# Altium schematic sheet 11 SDRAM.SchDoc
size A2; VersionControl_RevNumber: DNP; IsUserConfigurable: DNP; OrgAddr3: Sunrise FL 33323; OrgName: Pixels on Target; Page Create Date: March  8, 1995; Page Number: 5; Page Size: A2; Page Count: 14; OrgAddr2: Suite #104; RevCode: A; Doc: SCH30-00070-00; DsnPath: C:\Users\Carter Nichols\Documents\BitBucket boards (Cadence)\30-00070-00_Original\SCH30-00070-00.DSN; SchematicName: SC30-00070-00; PageName: 05-POWER IN; PageSize: A2; TopSchematic: True; Address4: United States
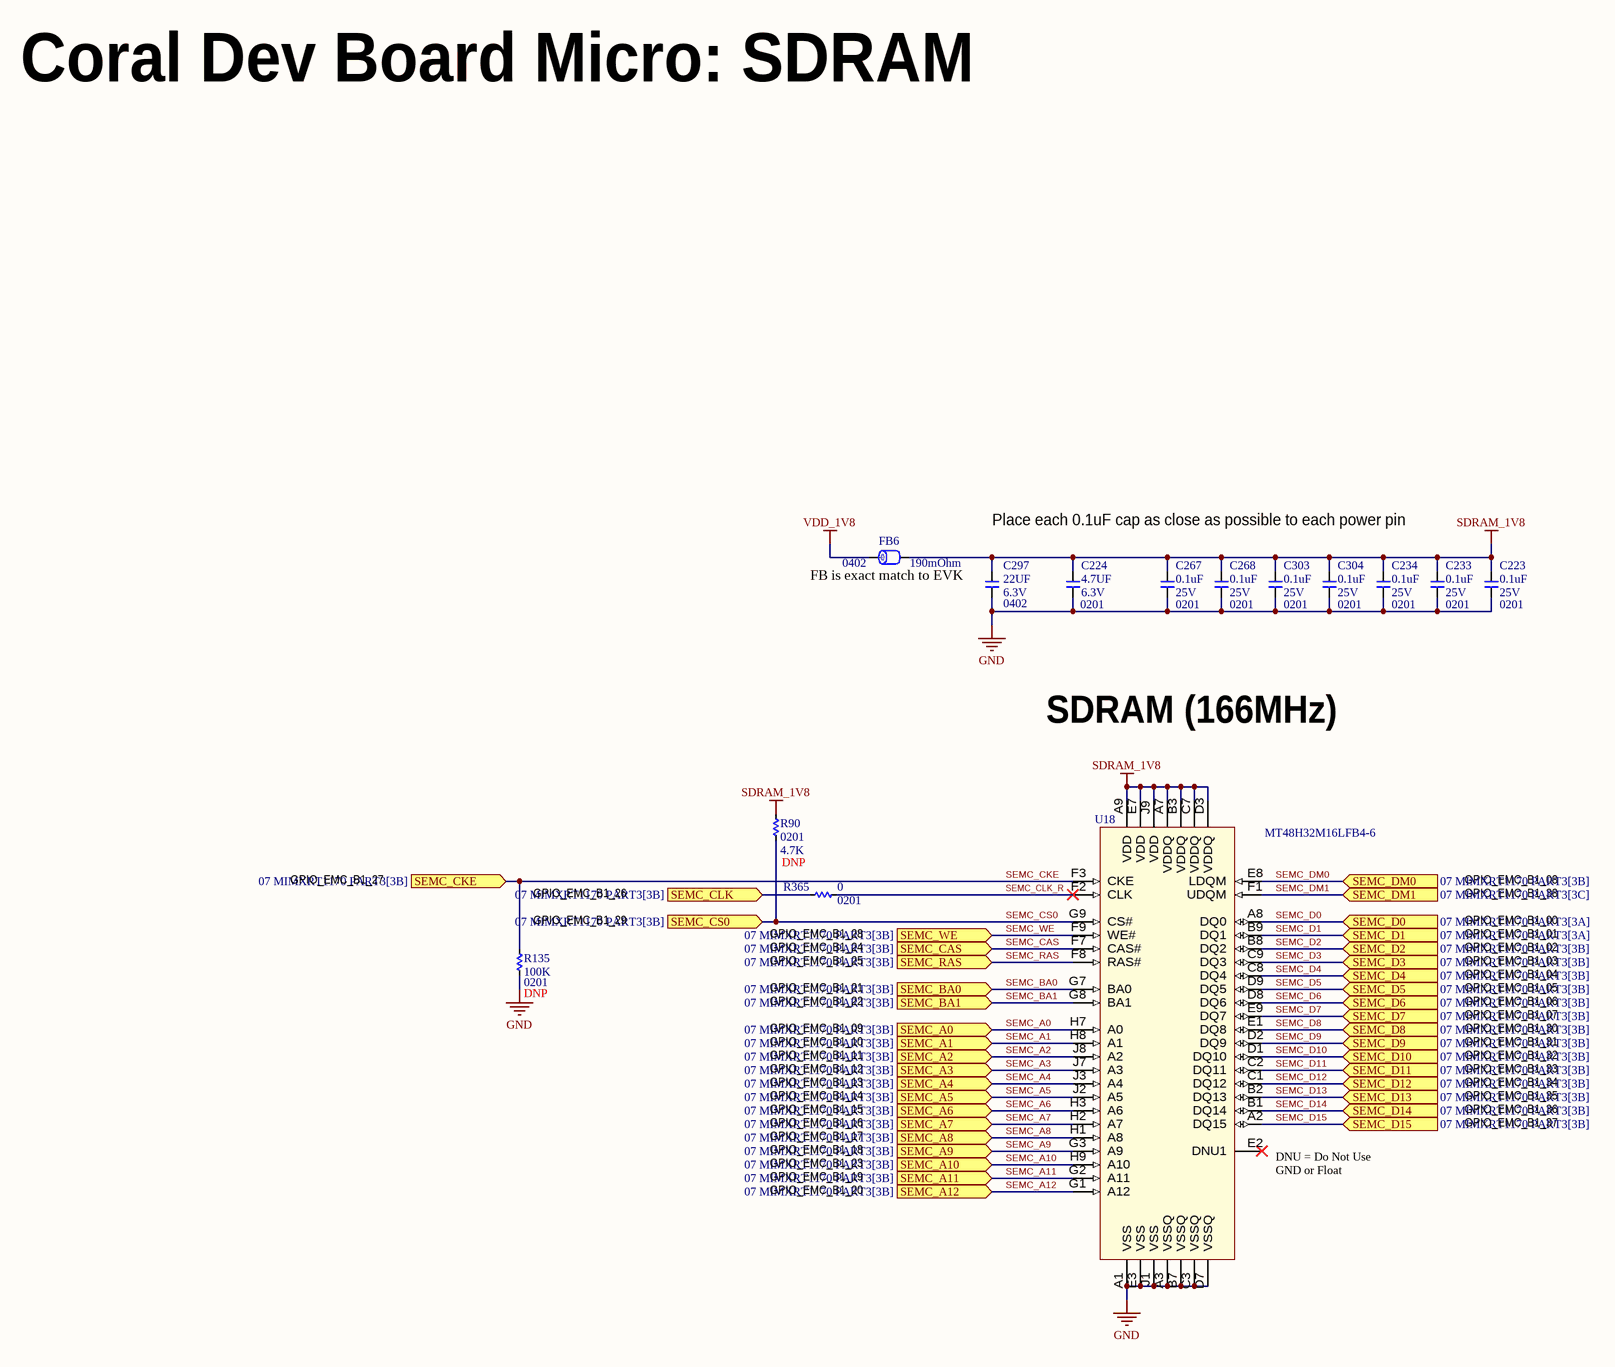
[diagram p0: 11 SDRAM.SchDoc]

## Parts
C223  value 0.1uF  Package: 0201  Voltage: 25V  [C0201Y]  (hidden comment: __Template_Cap)
C224  value 4.7UF  Package: 0201  Voltage: 6.3V  [C0201Y]  (hidden comment: __Template_Cap)
C233  value 0.1uF  Package: 0201  Voltage: 25V  [C0201Y]  (hidden comment: __Template_Cap)
C234  value 0.1uF  Package: 0201  Voltage: 25V  [C0201Y]  (hidden comment: __Template_Cap)
C267  value 0.1uF  Package: 0201  Voltage: 25V  [C0201Y]  (hidden comment: __Template_Cap)
C268  value 0.1uF  Package: 0201  Voltage: 25V  [C0201Y]  (hidden comment: __Template_Cap)
C297  value 22UF  Package: 0402  Voltage: 6.3V  [C0402]  (hidden comment: __Template_Cap)
C303  value 0.1uF  Package: 0201  Voltage: 25V  [C0201Y]  (hidden comment: __Template_Cap)
C304  value 0.1uF  Package: 0201  Voltage: 25V  [C0201Y]  (hidden comment: __Template_Cap)
FB6  Package: 0402  Rdc max: 190mOhm  [L0402_H0.55MM]  (hidden comment: __Template_Ferrite_Bead)
R90  value 4.7K  Package: 0201  [R0201]
R135  value 100K  Package: 0201  [R0201]
R365  value 0  Package: 0201  [R0201]
U18  MFG P/N: MT48H32M16LFB4-6  [BGA54C80P6X9_800X800X100]  (hidden comment: SDRAM_MT48H32M16LFB4-6)

## Ports
SEMC_A0 (in, see 07 MIMXRT1170 PART3[3B]), SEMC_A1 (in, see 07 MIMXRT1170 PART3[3B]), SEMC_A2 (in, see 07 MIMXRT1170 PART3[3B]), SEMC_A3 (in, see 07 MIMXRT1170 PART3[3B]), SEMC_A4 (in, see 07 MIMXRT1170 PART3[3B]), SEMC_A5 (in, see 07 MIMXRT1170 PART3[3B]), SEMC_A6 (in, see 07 MIMXRT1170 PART3[3B]), SEMC_A7 (in, see 07 MIMXRT1170 PART3[3B]), SEMC_A8 (in, see 07 MIMXRT1170 PART3[3B]), SEMC_A9 (in, see 07 MIMXRT1170 PART3[3B]), SEMC_A10 (in, see 07 MIMXRT1170 PART3[3B]), SEMC_A11 (in, see 07 MIMXRT1170 PART3[3B]), SEMC_A12 (in, see 07 MIMXRT1170 PART3[3B]), SEMC_BA0 (in, see 07 MIMXRT1170 PART3[3B]), SEMC_BA1 (in, see 07 MIMXRT1170 PART3[3B]), SEMC_CAS (in, see 07 MIMXRT1170 PART3[3B]), SEMC_CKE (in, see 07 MIMXRT1170 PART3[3B]), SEMC_CLK (in, see 07 MIMXRT1170 PART3[3B]), SEMC_CS0 (in, see 07 MIMXRT1170 PART3[3B]), SEMC_D0 (in, see 07 MIMXRT1170 PART3[3A]), SEMC_D1 (in, see 07 MIMXRT1170 PART3[3A]), SEMC_D2 (in, see 07 MIMXRT1170 PART3[3B]), SEMC_D3 (in, see 07 MIMXRT1170 PART3[3B]), SEMC_D4 (in, see 07 MIMXRT1170 PART3[3B]), SEMC_D5 (in, see 07 MIMXRT1170 PART3[3B]), SEMC_D6 (in, see 07 MIMXRT1170 PART3[3B]), SEMC_D7 (in, see 07 MIMXRT1170 PART3[3B]), SEMC_D8 (in, see 07 MIMXRT1170 PART3[3B]), SEMC_D9 (in, see 07 MIMXRT1170 PART3[3B]), SEMC_D10 (in, see 07 MIMXRT1170 PART3[3B]), SEMC_D11 (in, see 07 MIMXRT1170 PART3[3B]), SEMC_D12 (in, see 07 MIMXRT1170 PART3[3B]), SEMC_D13 (in, see 07 MIMXRT1170 PART3[3B]), SEMC_D14 (in, see 07 MIMXRT1170 PART3[3B]), SEMC_D15 (in, see 07 MIMXRT1170 PART3[3B]), SEMC_DM0 (in, see 07 MIMXRT1170 PART3[3B]), SEMC_DM1 (in, see 07 MIMXRT1170 PART3[3C]), SEMC_RAS (in, see 07 MIMXRT1170 PART3[3B]), SEMC_WE (in, see 07 MIMXRT1170 PART3[3B])

## Nets
GND: C223.2 C224.2 C233.2 C234.2 C267.2 C268.2 C297.2 C303.2 C304.2 R135.1 U18.A1(VSS) U18.A3(VSSQ) U18.B7(VSSQ) U18.C3(VSSQ) U18.D7(VSSQ) U18.E3(VSS) U18.J1(VSS)
SDRAM_1V8: C223.1 C224.1 C233.1 C234.1 C267.1 C268.1 C297.1 C303.1 C304.1 FB6.2 R90.2 U18.A7(VDDQ) U18.A9(VDD) U18.B3(VDDQ) U18.C7(VDDQ) U18.D3(VDDQ) U18.E7(VDD) U18.J9(VDD)
VDD_1V8: FB6.1
SEMC_A0: U18.H7(A0) ; port SEMC_A0
SEMC_A1: U18.H8(A1) ; port SEMC_A1
SEMC_A2: U18.J8(A2) ; port SEMC_A2
SEMC_A3: U18.J7(A3) ; port SEMC_A3
SEMC_A4: U18.J3(A4) ; port SEMC_A4
SEMC_A5: U18.J2(A5) ; port SEMC_A5
SEMC_A6: U18.H3(A6) ; port SEMC_A6
SEMC_A7: U18.H2(A7) ; port SEMC_A7
SEMC_A8: U18.H1(A8) ; port SEMC_A8
SEMC_A9: U18.G3(A9) ; port SEMC_A9
SEMC_A10: U18.H9(A10) ; port SEMC_A10
SEMC_A11: U18.G2(A11) ; port SEMC_A11
SEMC_A12: U18.G1(A12) ; port SEMC_A12
SEMC_BA0: U18.G7(BA0) ; port SEMC_BA0
SEMC_BA1: U18.G8(BA1) ; port SEMC_BA1
SEMC_CAS: U18.F7(CAS#) ; port SEMC_CAS
SEMC_CKE: R135.2 U18.F3(CKE) ; port SEMC_CKE
SEMC_CLK: R365.1 ; port SEMC_CLK
SEMC_CLK_R: R365.2 U18.F2(CLK)
SEMC_CS0: R90.1 U18.G9(CS#) ; port SEMC_CS0
SEMC_D0: U18.A8(DQ0) ; port SEMC_D0
SEMC_D1: U18.B9(DQ1) ; port SEMC_D1
SEMC_D2: U18.B8(DQ2) ; port SEMC_D2
SEMC_D3: U18.C9(DQ3) ; port SEMC_D3
SEMC_D4: U18.C8(DQ4) ; port SEMC_D4
SEMC_D5: U18.D9(DQ5) ; port SEMC_D5
SEMC_D6: U18.D8(DQ6) ; port SEMC_D6
SEMC_D7: U18.E9(DQ7) ; port SEMC_D7
SEMC_D8: U18.E1(DQ8) ; port SEMC_D8
SEMC_D9: U18.D2(DQ9) ; port SEMC_D9
SEMC_D10: U18.D1(DQ10) ; port SEMC_D10
SEMC_D11: U18.C2(DQ11) ; port SEMC_D11
SEMC_D12: U18.C1(DQ12) ; port SEMC_D12
SEMC_D13: U18.B2(DQ13) ; port SEMC_D13
SEMC_D14: U18.B1(DQ14) ; port SEMC_D14
SEMC_D15: U18.A2(DQ15) ; port SEMC_D15
SEMC_DM0: U18.E8(LDQM) ; port SEMC_DM0
SEMC_DM1: U18.F1(UDQM) ; port SEMC_DM1
SEMC_RAS: U18.F8(RAS#) ; port SEMC_RAS
SEMC_WE: U18.F9(WE#) ; port SEMC_WE

Not connected (* = marked no-connect by the designer): U18 E2(DNU1)*

## Notes on the sheet
- Coral Dev Board Micro: SDRAM
- FB is exact match to EVK
- Place each 0.1uF cap as close as possible to each power pin
- SDRAM (166MHz)
- GPIO_EMC_B1_27
- GPIO_EMC_B1_26
- GPIO_EMC_B1_38
- GPIO_EMC_B1_08
- (near R135) GPIO_EMC_B1_29
- GPIO_EMC_B1_21
- GPIO_EMC_B1_25
- (near R365) GPIO_EMC_B1_24
- (near R365) GPIO_EMC_B1_28
- GPIO_EMC_B1_00
- GPIO_EMC_B1_01
- GPIO_EMC_B1_02
- GPIO_EMC_B1_03
- GPIO_EMC_B1_04
- GPIO_EMC_B1_05
- GPIO_EMC_B1_10
- GPIO_EMC_B1_09
- GPIO_EMC_B1_22
- GPIO_EMC_B1_06
- GPIO_EMC_B1_07
- GPIO_EMC_B1_30
- GPIO_EMC_B1_31
- GPIO_EMC_B1_11
- GPIO_EMC_B1_12
- GPIO_EMC_B1_13
- GPIO_EMC_B1_14
- GPIO_EMC_B1_15
- GPIO_EMC_B1_16
- GPIO_EMC_B1_32
- GPIO_EMC_B1_33
- GPIO_EMC_B1_34
- GPIO_EMC_B1_35
- GPIO_EMC_B1_36
- GPIO_EMC_B1_37
- GPIO_EMC_B1_17
- GPIO_EMC_B1_18
- GPIO_EMC_B1_19
- GPIO_EMC_B1_23
- (near U18) DNU = Do Not Use
- (near U18) GND or Float
- GPIO_EMC_B1_20
- Title
- Size:
- Date:
- File:
- A2
- Number:
- Time:
- Revision:
- Sheet
- of

## Library data of the parts
C223 C233 C234 C267 C268 C303 C304 = 386: CAP, CER, X5R, 0.1uF, 25V, 20%, 0201, 0.33mm T; ID: 386; MFG: MURATA; MFG P/N: GRM033R61E104ME14D; XPN: 150-01204-00; Status: Released; Dielectric: X5R; Tolerance: 20%; Height: 0.33mm T; ComponentLink1Description: Datasheet; COMMON: 150-01204-00; LOON: 150-01204-00; Gecko: 150-01204-00
C224 = 1199: CAP, CER, X5R, 4.7uF, 20%, 6.3V, 0201; ID: 1199; MFG: MURATA; MFG P/N: GRM035R60J475ME15D; XPN: 150-01224-00; PROXY: 150-03477-00; Status: Released; Dielectric: X5R; Tolerance: 20%; Height: 0.33mm T; ComponentLink1Description: Datasheet; COMMON: 150-01224-00; LOON: 150-01224-00; Gecko: 150-01224-00
C297 = 1719: CAP, CER, X5R, 22uF, 20%, 6.3V, 0402; ID: 1719; MFG: AVX; MFG P/N: 04026D226MAT2A; XPN: 150-00420-00; PROXY: 150-03491-00; Status: Released; Dielectric: X5R; Tolerance: 20%; Height: 0.70mm; Supplier 1: Digi-Key; HelpURL: https://www.digikey.in/product-detail/en/avx-corporation/04026D226MAT2A/478-9839-1-ND/5964924; ComponentLink1Description: Datasheet; ComponentLink1URL: http://datasheets.avx.com/cx5r.pdf; COMMON: 150-00420-00; LOON: 150-00420-00; Gecko: 150-00420-00; Supplier Part Number 1: 478-9839-1-ND
FB6 = 913: FERRITE, BEAD, 120 OHMS@100MHZ, 25%, 550mA, 190 mOHM DCR, 0402; ID: 913; Catagory: Ferrite Bead; MFG: Murata Electronics; MFG P/N: BLM15AG121SN1D; ComponentLink1Description: Datasheet; Status: Released; Idc max: 550mA; Supplier 1: Digi-Key; HelpURL: https://www.digikey.com/product-detail/en/murata-electronics/BLM15AG121SN1D/490-1005-1-ND/584453; ComponentLink1URL: https://www.murata.com/en-us/products/productdata/8796740059166/ENFA0018.pdf; Height: 0.55mm; Supplier Part Number 1: 490-1005-1-ND
R90 = 6602: RES, 4.7K, 5%, 1/20W, 0201; ID: 6602; MFG: YAGEO; MFG P/N: RC0201JR-074K7L; COMMON: 470-00012-00; Status: Released; Power: 1/20W; Tolerance: 5%; LOON: 470-00012-00; Gecko: 470-00012-00; XPN: 470-00012-00; DNP: DNP
R135 = 6760: RES, 100K, 1%, 1/20W, 0201; ID: 6760; MFG: PANASONIC; MFG P/N: ERJ1GNF1003C; COMMON: 470-00506-00; Status: Released; Power: 1/20W; Tolerance: 1%; LOON: 470-00506-00; Gecko: 470-00506-00; XPN: 470-00506-00; DNP: DNP
R365 = 8315: RES, 0.0, 1/20W, 0201; ID: 8315; MFG: PANASONIC; MFG P/N: ERJ1GN0R00C; Tolerance: JUMPER; COMMON: 470-00013-00; PROXY: Use ID #6940; Status: Released; Power: 1/20W; LOON: 470-00013-00; Gecko: 470-00013-00; XPN: 470-00013-00
U18 = 427: IC, MEMORY, MT48H32M16, VOLATILE, DRAM, 512Mb(32M x 16), 1.7 TO 1.95V VIN, VFBGA-54; ID: 427; MFG: Micron Technology Inc.; Status: Released; Package: 54-VFBGA (8x8); Category: Integrated Circuits (ICs); RoHS Compliant: Yes; Supplier 1: Digi-Key; ComponentLink1Description: Datasheet; ComponentLink1URL: https://drive.google.com/file/d/1ZqN_IvmDCh6UxoJlg56_oHNDqlNjxBG5/view; Mounting Type: SMD; Height: 1mm; Supplier Part Number 1: MT48H32M16LFB4-6IT:C-ND; HelpURL: https://www.digikey.com/en/products/detail/micron-technology-inc/mt48h32m16lfb4-6-it-c/4315912